# EAGLE design D1MPIXEL (EAGLE 8.2.2)
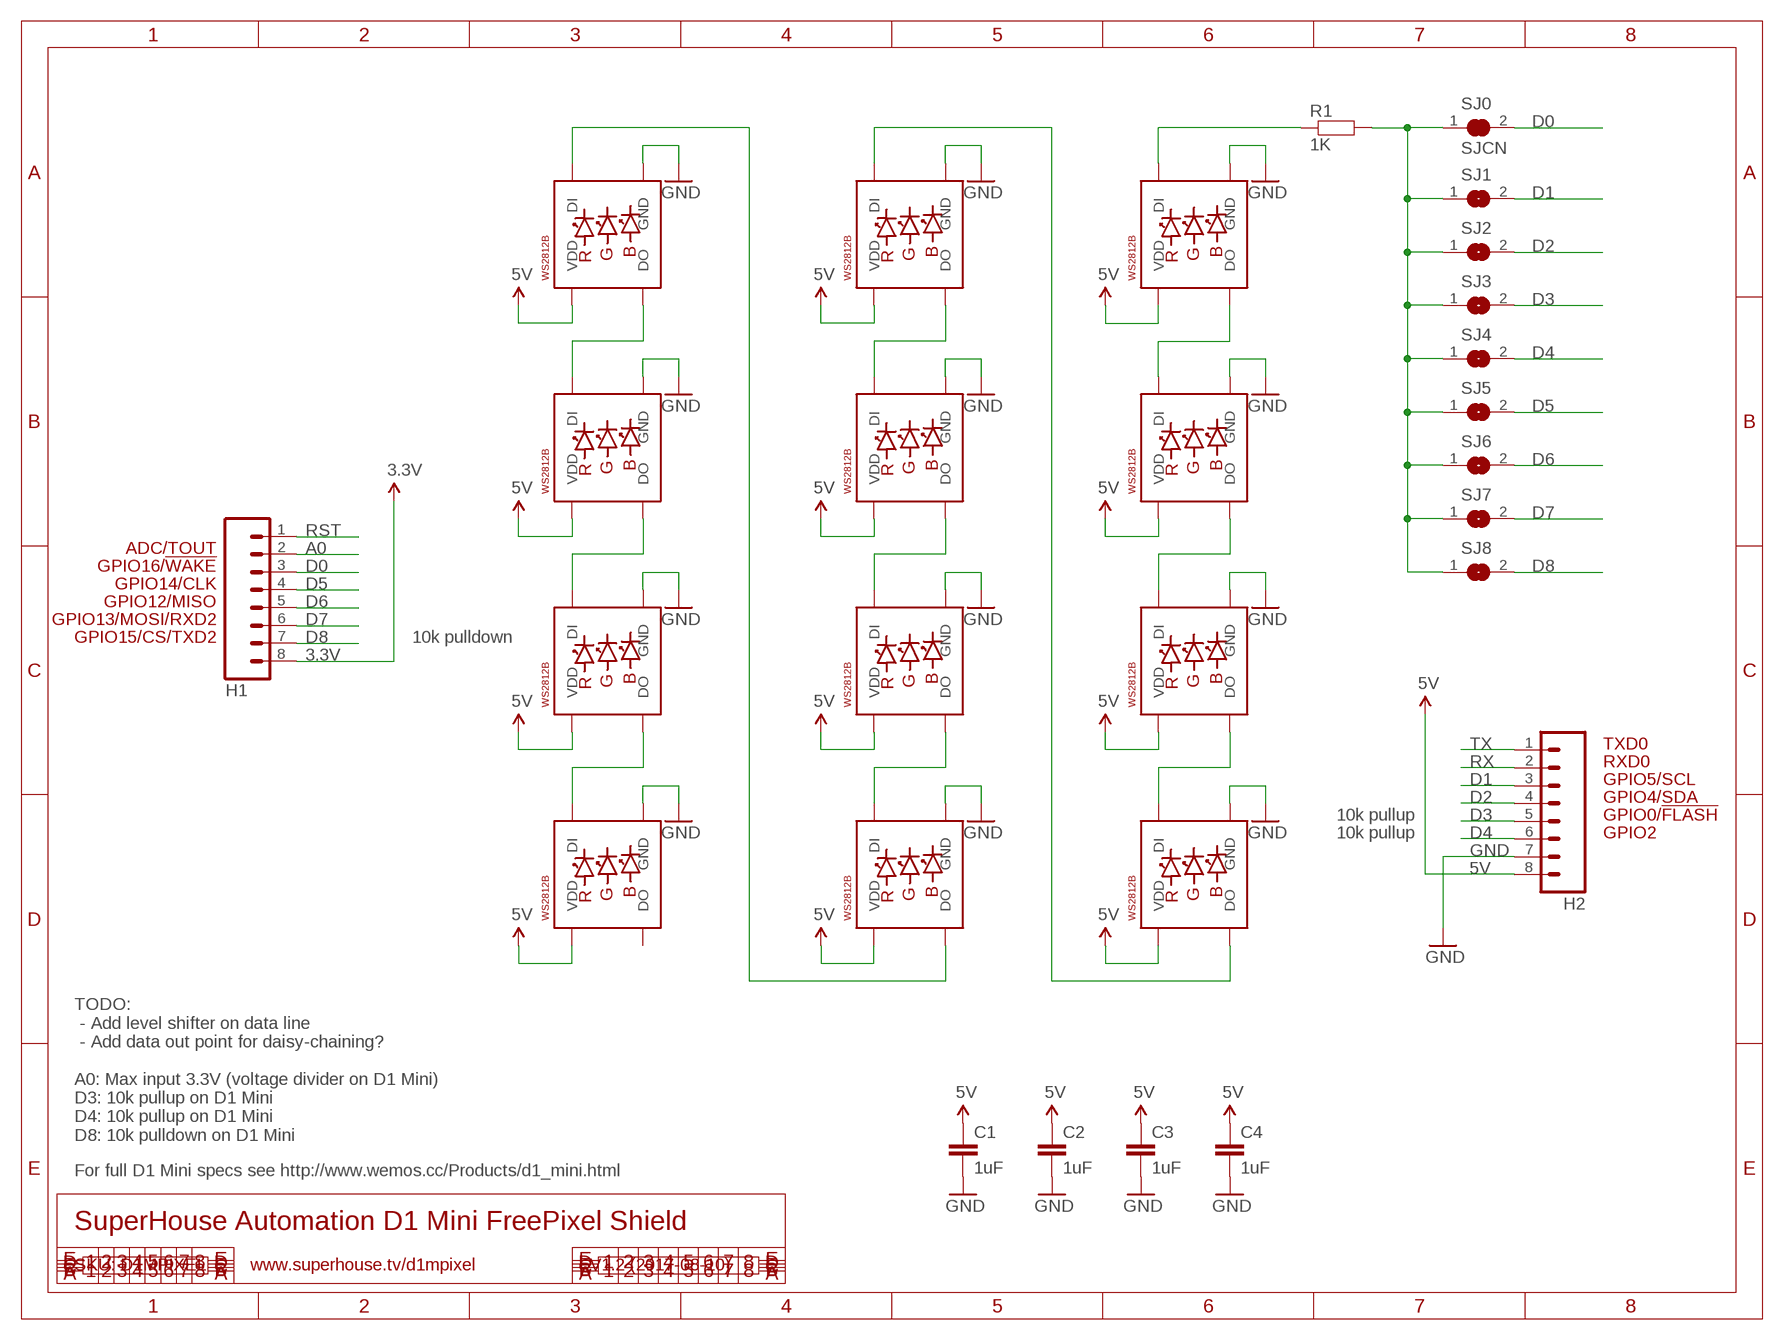
[diagram p0: schematic, sheet 1]

## Parts
C1  1uF  CAP0603  [0603]
C2  1uF  CAP0603  [0603]
C3  1uF  CAP0603  [0603]
C4  1uF  CAP0603  [0603]
H1  M08  [1X08]
H2  M08  [1X08]
LED1  WS2812B5050  [WS2812B]
LED2  WS2812B5050  [WS2812B]
LED3  WS2812B5050  [WS2812B]
LED4  WS2812B5050  [WS2812B]
LED5  WS2812B5050  [WS2812B]
LED6  WS2812B5050  [WS2812B]
LED7  WS2812B5050  [WS2812B]
LED8  WS2812B5050  [WS2812B]
LED9  WS2812B5050  [WS2812B]
LED10  WS2812B5050  [WS2812B]
LED11  WS2812B5050  [WS2812B]
LED12  WS2812B5050  [WS2812B]
R1  1K  RESISTOR0603  [0603]
SJ0  SJCN  [SJC]
SJ1  SJN  [SJ]
SJ2  SJN  [SJ]
SJ3  SJN  [SJ]
SJ4  SJN  [SJ]
SJ5  SJN  [SJ]
SJ6  SJN  [SJ]
SJ7  SJN  [SJ]
SJ8  SJN  [SJ]

## Nets
3.3V: H1.8
5V: C1.1 C2.1 C3.1 C4.1 H2.8 LED1.1-VDD(VDD) LED2.1-VDD(VDD) LED3.1-VDD(VDD) LED4.1-VDD(VDD) LED5.1-VDD(VDD) LED6.1-VDD(VDD) LED7.1-VDD(VDD) LED8.1-VDD(VDD) LED9.1-VDD(VDD) LED10.1-VDD(VDD) LED11.1-VDD(VDD) LED12.1-VDD(VDD)
A0: H1.2
D0: H1.3 SJ0.2
D1: H2.3 SJ1.2
D2: H2.4 SJ2.2
D3: H2.5 SJ3.2
D4: H2.6 SJ4.2
D5: H1.4 SJ5.2
D6: H1.5 SJ6.2
D7: H1.6 SJ7.2
D8: H1.7 SJ8.2
GND: C1.2 C2.2 C3.2 C4.2 H2.7 LED1.3-GND(GND) LED2.3-GND(GND) LED3.3-GND(GND) LED4.3-GND(GND) LED5.3-GND(GND) LED6.3-GND(GND) LED7.3-GND(GND) LED8.3-GND(GND) LED9.3-GND(GND) LED10.3-GND(GND) LED11.3-GND(GND) LED12.3-GND(GND)
N$1: LED1.2-DOUT(DO) LED2.4-DIN(DI)
N$2: LED2.2-DOUT(DO) LED3.4-DIN(DI)
N$3: LED3.2-DOUT(DO) LED4.4-DIN(DI)
N$4: LED5.2-DOUT(DO) LED6.4-DIN(DI)
N$5: LED6.2-DOUT(DO) LED7.4-DIN(DI)
N$6: LED7.2-DOUT(DO) LED8.4-DIN(DI)
N$7: LED11.2-DOUT(DO) LED12.4-DIN(DI)
N$8: LED10.2-DOUT(DO) LED11.4-DIN(DI)
N$9: LED9.2-DOUT(DO) LED10.4-DIN(DI)
N$10: LED4.2-DOUT(DO) LED5.4-DIN(DI)
N$11: LED8.2-DOUT(DO) LED9.4-DIN(DI)
N$12: R1.2 SJ0.1 SJ1.1 SJ2.1 SJ3.1 SJ4.1 SJ5.1 SJ6.1 SJ7.1 SJ8.1
N$15: LED1.4-DIN(DI) R1.1
RST: H1.1
RX: H2.2
TX: H2.1
Unconnected: LED12.2-DOUT(DO)

## Notes on the sheet
- ADC/TOUT
- GPIO16/!WAKE
- GPIO14/CLK
- GPIO12/MISO
- GPIO13/MOSI/RXD2
- GPIO15/CS/TXD2 | 10k pulldown
- TXD0
- RXD0
- GPIO5/SCL
- GPIO4/SDA
- 10k pullup | GPIO0/!FLASH
- 10k pullup | GPIO2
- TODO:
   - Add level shifter on data line
   - Add data out point for daisy-chaining?
  
  A0: Max input 3.3V (voltage divider on D1 Mini)
  D3: 10k pullup on D1 Mini
  D4: 10k pullup on D1 Mini
  D8: 10k pulldown on D1 Mini
- For full D1 Mini specs see http://www.wemos.cc/Products/d1_mini.html
- SuperHouse Automation D1 Mini FreePixel Shield
- SKU: D1MPIXEL | www.superhouse.tv/d1mpixel | V1.2 (2017-08-10)

## Library data of the parts
C1-C4 = freetronics-jon:CAP: Capacitor Standard 0603 ceramic capacitor, and 0.1" leaded capacitor.
H1 H2 = freetronics-original:M08: Header 8 Standard 8-pin 0.1" header. Use with straight break away headers (SKU : PRT-00116), right angle break away headers (PRT-00553), swiss pins (PRT-00743), machine pins (PRT-00117), and female headers (PRT-00115).
LED1-LED12 = freetronics-jon:WS2812B
R1 = freetronics-jon:RESISTOR: Resistor Basic schematic elements and footprints for 0603, 1206, and PTH 1/10th watt (small) resistors.
SJ0 = freetronics-jon:SJC
SJ1-SJ8 = freetronics-jon:SJ: SMD solder JUMPER

## Net classes
0 default: width 0.203 mm, drill 0.356 mm, clearance 0.152 mm
1 power: width 0.203 mm, clearance 0.152 mm

## Board
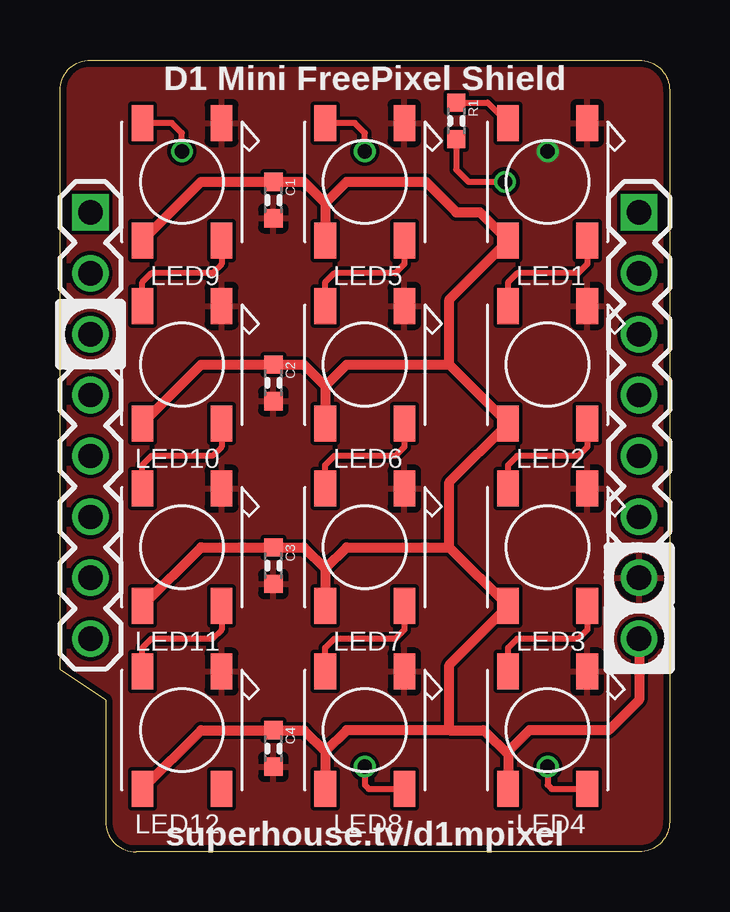
[diagram p1: board, top side]
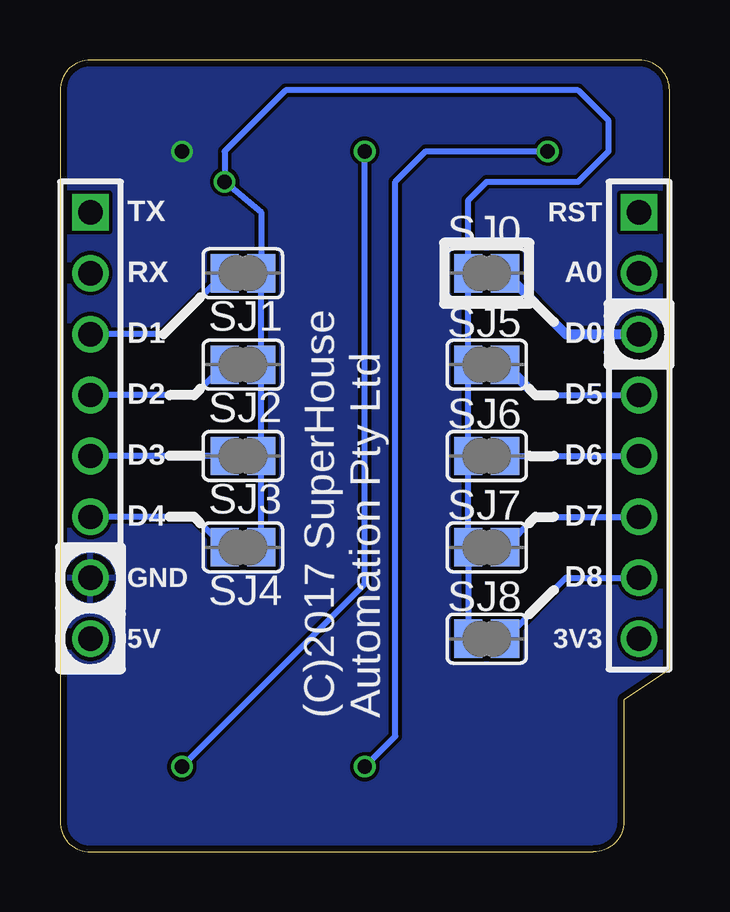
[diagram p2: board, bottom side, seen from below]

Size 25.4 x 33.02 mm. Coordinates in mm from the lower left corner, seen from the top.
Outline: 25.4,31.75 25.4,1.27 arc-90 24.13,0 3.17,0 arc-90 1.91,1.27 1.91,6.35 0,7.62 0,31.75 arc-90 1.27,33.02 24.13,33.02 arc-90 25.4,31.75
Copper layers (1*16): Top 0.035mm / dielectric 1.5mm / Bottom 0.035mm
Design rules "dirt_cheap_dirty_boards.v1": minimum track width 5mil, minimum drill 12mil, track to track 5mil, track to pad 5mil, pad to pad 5mil, via to via 5mil, smd to smd 0mil, copper to edge 10mil, drill to drill 10mil, minimum pad ring 10mil, minimum via ring 6mil, stop-mask expansion 2mil, vias tented up to drill 25mil, thermal gap 10mil

### Footprints (pad centres in the part's own frame; a part is rotated, then mirrored left to right if it is on the bottom)
0603 = smd 0.762 x 0.762: 1 -0.762,0; 2 0.762,0
1X08 = drill 1.016 square: 1 0,0 | drill 1.016: 2 2.54,0; 3 5.08,0; 4 7.62,0; 5 10.16,0; 6 12.7,0; 7 15.24,0; 8 17.78,0
WS2812B = smd 1.5 x 0.9: 1-VDD 2.45,-1.65; 2-DOUT 2.45,1.65; 3-GND -2.45,1.65; 4-DIN -2.45,-1.65
SJC = smd 1.168 x 1.6: 1 -0.762,0; 2 0.762,0
SJ = smd 1.168 x 1.6: 1 -0.762,0; 2 0.762,0

### Placement (x,y rotation side)
C1  8.89,27.18 270 top
C2  8.89,19.56 270 top
C3  8.89,11.94 270 top
C4  8.89,4.32 270 top
H1  1.27,26.67 270 top
H2  24.13,26.67 270 top
LED1  20.32,27.94 270 top
LED2  20.32,20.32 270 top
LED3  20.32,12.7 270 top
LED4  20.32,5.08 270 top
LED5  12.7,27.94 270 top
LED6  12.7,20.32 270 top
LED7  12.7,12.7 270 top
LED8  12.7,5.08 270 top
LED9  5.08,27.94 270 top
LED10  5.08,20.32 270 top
LED11  5.08,12.7 270 top
LED12  5.08,5.08 270 top
R1  16.51,30.48 270 top
SJ0  7.62,24.13 0 bottom
SJ1  17.78,24.13 180 bottom
SJ2  17.78,20.32 180 bottom
SJ3  17.78,16.51 180 bottom
SJ4  17.78,12.7 180 bottom
SJ5  7.62,20.32 0 bottom
SJ6  7.62,16.51 0 bottom
SJ7  7.62,12.7 0 bottom
SJ8  7.62,8.89 0 bottom

### Tracks (layer width: path | path; a pad name or v marks a point on that pad's centre or on a via)
5V
  Top 0.406: 16.22,5.08 11.94,5.08 11.05,4.19 | LED12.1-VDD 5.88,5.08 C4.1 10.16,5.08 11.05,4.19 | 16.22,12.7 11.94,12.7 11.05,11.81 | 16.22,12.7 LED3.1-VDD 16.22,7.8 16.22,5.08 | LED11.1-VDD 5.88,12.7 C3.1 10.16,12.7 11.05,11.81 | LED10.1-VDD 5.88,20.32 C2.1 10.16,20.32 11.05,19.43 | LED9.1-VDD 5.88,27.94 C1.1 10.16,27.94 11.05,27.05 | 16.22,20.32 11.94,20.32 11.05,19.43 | 16.22,20.32 LED2.1-VDD 16.22,15.42 16.22,12.7 | 16.22,20.32 16.22,23.04 LED1.1-VDD 17.49,26.67 16.51,26.67 15.24,27.94 11.94,27.94 11.05,27.05 | H2.8 24.13,6.35 22.86,5.08 19.56,5.08 18.67,4.19 18.67,4.06 | 18.67,4.06 LED4.1-VDD | 16.22,5.08 17.65,5.08 18.67,4.06 | 11.05,4.19 LED8.1-VDD | 11.05,11.81 LED7.1-VDD | 11.05,19.43 LED6.1-VDD | 11.05,27.05 LED5.1-VDD
D0
  Bottom 0.406: SJ0.2 4.32,21.59 H1.3
D1
  Bottom 0.254: SJ1.2 21.08,21.59 H2.3
D2
  Bottom 0.254: SJ2.2 19.81,19.05 H2.4
D3
  Bottom 0.254: SJ3.2 H2.5
D4
  Bottom 0.254: SJ4.2 19.81,13.97 H2.6
D5
  Bottom 0.254: 5.59,19.05 H1.4
  Bottom 0.406: SJ5.2 5.59,19.05
D6
  Bottom 0.254: SJ6.2 H1.5
D7
  Bottom 0.254: SJ7.2 5.59,13.97 H1.6
D8
  Bottom 0.254: SJ8.2 4.32,11.43 H1.7
GND  (via drill 0.6)
  other vias: 20.32,29.21
  pour Top: 25.4,31.75 arc90 24.13,33.02 1.27,33.02 arc90 0,31.75 0,7.62 1.91,6.35 1.91,1.27 arc90 3.17,0 24.13,0 arc90 25.4,1.27
  pour Bottom: 25.4,1.27 25.4,31.75 arc90 24.13,33.02 1.27,33.02 arc90 0,31.75 0,7.62 1.91,6.35 1.91,1.27 arc90 3.17,0 24.13,0 arc90
N$1
  Top 0.254: LED1.2-DOUT 21.97,24.51 21.59,24.13 19.05,24.13 18.67,23.75 LED2.4-DIN
N$2
  Top 0.254: LED2.2-DOUT 21.97,16.89 21.59,16.51 19.05,16.51 18.67,16.13 LED3.4-DIN
N$3
  Top 0.254: LED3.2-DOUT 21.97,9.27 21.59,8.89 19.05,8.89 18.67,8.51 LED4.4-DIN
N$4
  Top 0.254: LED5.2-DOUT 14.35,24.51 13.97,24.13 11.43,24.13 11.05,23.75 LED6.4-DIN
N$5
  Top 0.254: LED6.2-DOUT 14.35,16.89 13.97,16.51 11.43,16.51 11.05,16.13 LED7.4-DIN
N$6
  Top 0.254: LED7.2-DOUT 14.35,9.27 13.97,8.89 11.43,8.89 11.05,8.51 LED8.4-DIN
N$7
  Top 0.254: LED11.2-DOUT 6.73,9.27 6.35,8.89 3.81,8.89 3.43,8.51 LED12.4-DIN
N$8
  Top 0.254: LED10.2-DOUT 6.73,16.89 6.35,16.51 3.81,16.51 3.43,16.13 LED11.4-DIN
N$9
  Top 0.254: LED9.2-DOUT 6.73,24.51 6.35,24.13 3.81,24.13 3.43,23.75 LED10.4-DIN
N$10  (via drill 0.6)
  Top 0.254: v12.7,29.21 12.7,29.97 12.28,30.39 LED5.4-DIN | v20.32,3.56 20.32,2.79 20.48,2.63 LED4.2-DOUT
  Top 0.406: LED4.2-DOUT 21.88,2.54
  Bottom 0.254: v20.32,3.56 12.7,11.18 v12.7,29.21
N$11  (via drill 0.6)
  Top 0.254: v5.08,29.21 5.08,29.97 4.66,30.39 LED9.4-DIN | v12.7,3.56 12.7,2.79 12.86,2.63 LED8.2-DOUT
  Top 0.406: LED8.2-DOUT 14.26,2.54 | 3.52,30.48 LED9.4-DIN
  Bottom 0.254: v12.7,3.56 11.43,4.83 11.43,27.94 10.16,29.21 v5.08,29.21
N$12  (via drill 0.6)
  Top 0.254: R1.2 16.51,28.45 17.02,27.94 v18.54,27.94
  Bottom 0.254: SJ8.1 SJ7.1 SJ6.1 SJ5.1 SJ0.1 8.38,27.18 7.62,27.94 3.81,27.94 2.54,29.21 2.54,30.48 3.81,31.75 16,31.75 18.54,29.21 v18.54,27.94 17.02,26.67 SJ1.1 SJ2.1 SJ3.1 SJ4.1
N$15
  Top 0.254: R1.1 17.82,31.24 LED1.4-DIN

### Text on the board
tPlace: D1 Mini FreePixel Shield | superhouse.tv/d1mpixel
bPlace: RST | TX | A0 | RX | D0 | D1 | D5 | D2 | D6 | D3 | D7 | D4 | D8 | GND | 3V3 | 5V | (C)2017 SuperHouse / Automation Pty Ltd